# Altium schematic sheet DRV8873.SchDoc
size A3
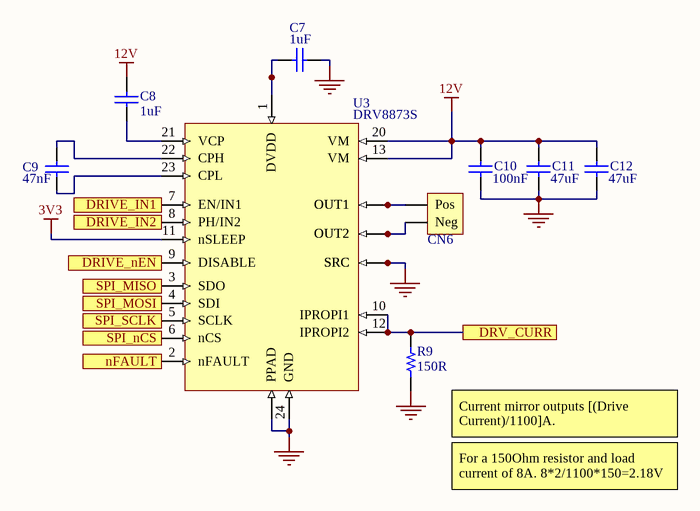
[diagram p0: DRV8873.SchDoc]

## Parts
C7  value 1uF  [0402]  (hidden comment: Cap)
C8  value 1uF  [0402]  (hidden comment: Cap)
C9  value 47nF  [0402]  (hidden comment: Cap)
C10  value 100nF  [0402]  (hidden comment: Cap)
C11  value 47uF  [1206]  (hidden comment: Cap)
C12  value 47uF  [1206]  (hidden comment: Cap)
CN6  JST_Leads_In  [Power_Leads]  (value not drawn)
R9  150R  [0805 - duplicate]
U3  DRV8873S  [HTSSOP24]

## Ports
DRIVE_IN1, DRIVE_IN2, DRIVE_nEN, DRV_CURR, nFAULT, SPI_MISO, SPI_MOSI, SPI_nCS, SPI_SCLK

## Nets
3V3: U3.11(nSLEEP)
12V: C8.2 C10.2 C11.2 C12.2 U3.13(VM) U3.20(VM)
GND: C7.2 C10.1 C11.1 C12.1 R9.1 U3.16(SRC) U3.17(SRC) U3.24(GND) U3.THERM(PPAD)
DRIVE_IN1: U3.7(EN/IN1) ; port DRIVE_IN1
DRIVE_IN2: U3.8(PH/IN2) ; port DRIVE_IN2
DRIVE_nEN: U3.9(DISABLE) ; port DRIVE_nEN
DRV_CURR: R9.2 U3.10(IPROPI1) U3.12(IPROPI2) ; port DRV_CURR
nFAULT: U3.2(nFAULT) ; port nFAULT
SPI_MISO: U3.3(SDO) ; port SPI_MISO
SPI_MOSI: U3.4(SDI) ; port SPI_MOSI
SPI_nCS: U3.6(nCS) ; port SPI_nCS
SPI_SCLK: U3.5(SCLK) ; port SPI_SCLK
NetC7_1: C7.1 U3.1(DVDD)
NetC8_1: C8.1 U3.21(VCP)
NetC9_1: C9.1 U3.23(CPL)
NetC9_2: C9.2 U3.22(CPH)
NetCN6_A: CN6.A(Pos) U3.18(OUT1) U3.19(OUT1)
NetCN6_K: CN6.K(Neg) U3.14(OUT2) U3.15(OUT2)

## Notes on the sheet
- (near R9) Current mirror outputs [(Drive Current)/1100]A.
- For a 150Ohm resistor and load current of 8A. 8*2/1100*150=2.18V

## Library data of the parts
R9 = Resistor
C7-C12 = Cap: Published: 8-Jun-2000; LatestRevisionDate: 17-Jul-2002; LatestRevisionNote: Re-released for DXP Platform.; PackageReference: RAD-0.3; Publisher: Altium Limited; PackageDescription: Radial Cap, Thru-Hole; 2 Leads; 0.3 in Pin Spacing